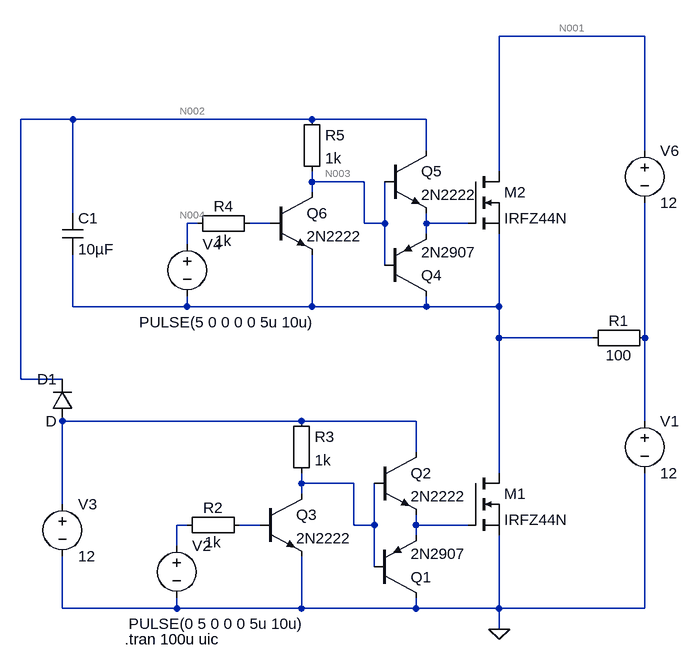
[diagram p0: schematic Drive5.asc]
Drive5.asc, the LTspice schematic file:
Version 4
SHEET 1 880 1392
WIRE -2688 448 -2912 448
WIRE -3568 576 -3648 576
WIRE -3200 576 -3568 576
WIRE -3024 576 -3200 576
WIRE -3024 624 -3024 576
WIRE -2688 624 -2688 448
WIRE -2912 656 -2912 448
WIRE -3200 672 -3200 656
WIRE -3120 672 -3200 672
WIRE -3200 688 -3200 672
WIRE -3568 720 -3568 576
WIRE -3376 736 -3392 736
WIRE -3264 736 -3296 736
WIRE -3120 736 -3120 672
WIRE -3088 736 -3088 672
WIRE -3088 736 -3120 736
WIRE -3024 736 -3024 720
WIRE -2960 736 -3024 736
WIRE -3024 752 -3024 736
WIRE -3392 768 -3392 736
WIRE -3088 800 -3088 736
WIRE -3568 864 -3568 784
WIRE -3392 864 -3392 848
WIRE -3392 864 -3568 864
WIRE -3200 864 -3200 784
WIRE -3200 864 -3392 864
WIRE -3024 864 -3024 848
WIRE -3024 864 -3200 864
WIRE -2912 864 -2912 752
WIRE -2912 864 -3024 864
WIRE -2912 912 -2912 864
WIRE -2768 912 -2912 912
WIRE -2688 912 -2688 704
WIRE -3648 976 -3648 576
WIRE -3584 976 -3648 976
WIRE -3216 1040 -3584 1040
WIRE -3040 1040 -3216 1040
WIRE -2688 1040 -2688 912
WIRE -3040 1088 -3040 1040
WIRE -2912 1120 -2912 912
WIRE -3216 1136 -3216 1120
WIRE -3136 1136 -3216 1136
WIRE -3216 1152 -3216 1136
WIRE -3584 1168 -3584 1040
WIRE -3392 1200 -3408 1200
WIRE -3280 1200 -3312 1200
WIRE -3136 1200 -3136 1136
WIRE -3104 1200 -3104 1136
WIRE -3104 1200 -3136 1200
WIRE -3040 1200 -3040 1184
WIRE -2960 1200 -3040 1200
WIRE -3040 1216 -3040 1200
WIRE -3408 1232 -3408 1200
WIRE -3104 1264 -3104 1200
WIRE -3584 1328 -3584 1248
WIRE -3408 1328 -3408 1312
WIRE -3408 1328 -3584 1328
WIRE -3216 1328 -3216 1248
WIRE -3216 1328 -3408 1328
WIRE -3040 1328 -3040 1312
WIRE -3040 1328 -3216 1328
WIRE -2912 1328 -2912 1216
WIRE -2912 1328 -3040 1328
WIRE -2688 1328 -2688 1120
WIRE -2688 1328 -2912 1328
WIRE -2912 1360 -2912 1328
FLAG -2912 1360 0
SYMBOL nmos -2960 1120 R0
SYMATTR InstName M1
SYMATTR Value IRFZ44N
SYMBOL voltage -2688 1024 R0
WINDOW 123 0 0 Left 0
WINDOW 39 0 0 Left 0
SYMATTR InstName V1
SYMATTR Value 12
SYMBOL Misc\\EuropeanResistor -2672 896 R90
WINDOW 0 5 56 VBottom 2
WINDOW 3 27 56 VTop 2
SYMATTR InstName R1
SYMATTR Value 100
SYMBOL Misc\\EuropeanResistor -3408 1216 R270
WINDOW 0 27 56 VTop 2
WINDOW 3 5 56 VBottom 2
SYMATTR InstName R2
SYMATTR Value 1k
SYMBOL voltage -3408 1216 R0
WINDOW 3 -74 136 Left 2
WINDOW 123 0 0 Left 0
WINDOW 39 0 0 Left 0
SYMATTR Value PULSE(0 5 0 0 0 5u 10u)
SYMATTR InstName V2
SYMBOL pnp -3104 1312 M180
SYMATTR InstName Q1
SYMATTR Value 2N2907
SYMBOL npn -3104 1088 R0
SYMATTR InstName Q2
SYMATTR Value 2N2222
SYMBOL voltage -3584 1152 R0
WINDOW 123 0 0 Left 0
WINDOW 39 0 0 Left 0
SYMATTR InstName V3
SYMATTR Value 12
SYMBOL Misc\\EuropeanResistor -3232 1024 R0
SYMATTR InstName R3
SYMATTR Value 1k
SYMBOL npn -3280 1152 R0
SYMATTR InstName Q3
SYMATTR Value 2N2222
SYMBOL nmos -2960 656 R0
SYMATTR InstName M2
SYMATTR Value IRFZ44N
SYMBOL Misc\\EuropeanResistor -3392 752 R270
WINDOW 0 27 56 VTop 2
WINDOW 3 5 56 VBottom 2
SYMATTR InstName R4
SYMATTR Value 1k
SYMBOL voltage -3392 752 R0
WINDOW 3 -74 136 Left 2
WINDOW 123 0 0 Left 0
WINDOW 39 0 0 Left 0
SYMATTR Value PULSE(5 0 0 0 0 5u 10u)
SYMATTR InstName V4
SYMBOL pnp -3088 848 M180
SYMATTR InstName Q4
SYMATTR Value 2N2907
SYMBOL npn -3088 624 R0
SYMATTR InstName Q5
SYMATTR Value 2N2222
SYMBOL Misc\\EuropeanResistor -3216 560 R0
SYMATTR InstName R5
SYMATTR Value 1k
SYMBOL npn -3264 688 R0
SYMATTR InstName Q6
SYMATTR Value 2N2222
SYMBOL voltage -2688 608 R0
WINDOW 123 0 0 Left 0
WINDOW 39 0 0 Left 0
SYMATTR InstName V6
SYMATTR Value 12
SYMBOL cap -3584 720 R0
SYMATTR InstName C1
SYMATTR Value 10µF
SYMBOL diode -3568 1040 R180
WINDOW 0 24 64 Left 2
WINDOW 3 24 0 Left 2
SYMATTR InstName D1
TEXT -3488 1376 Left 2 !.tran 100u uic

The netlist it stands for:
* Drive5.asc
M1 N007 N013 0 0 IRFZ44N
V1 N008 0 12
R1 N008 N007 100
R2 N011 N012 1k
V2 N011 0 PULSE(0 5 0 0 0 5u 10u)
Q1 0 N010 N013 0 2N2907
Q2 N009 N010 N013 0 2N2222
V3 N009 0 12
R3 N009 N010 1k
Q3 N010 N012 0 0 2N2222
M2 N001 N006 N007 N007 IRFZ44N
R4 N004 N005 1k
V4 N004 N007 PULSE(5 0 0 0 0 5u 10u)
Q4 N007 N003 N006 0 2N2907
Q5 N002 N003 N006 0 2N2222
R5 N002 N003 1k
Q6 N003 N005 N007 0 2N2222
V6 N001 N008 12
C1 N002 N007 10µF
D1 N009 N002 D
.model D D
.lib standard.dio
.model NPN NPN
.model PNP PNP
.lib standard.bjt
.model NMOS NMOS
.model PMOS PMOS
.lib standard.mos
.tran 100u uic
.backanno
.end

* Results of the author's LTspice run, read from the files saved beside the schematic
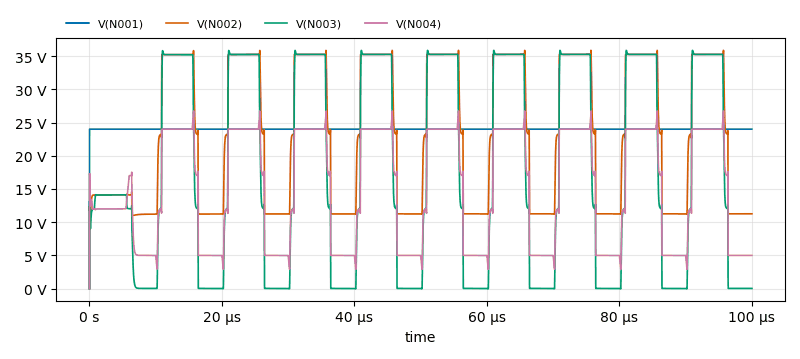
[diagram p1: Transient Analysis of Drive5.asc, plotted from the saved traces]
* Transient Analysis, 1 run:
*   V(N001): min 0 V, max 24 V, average 24 V, rms 24 V, last 24 V
*   V(N002): min 0 V, max 35.86 V, average 23.32 V, rms 25.85 V, last 11.26 V
*   V(N003): min -24.13 mV, max 35.86 V, average 17.61 V, rms 23.8 V, last 30.51 mV
*   V(N004): min 0 V, max 26.74 V, average 14.93 V, rms 17.31 V, last 5.002 V